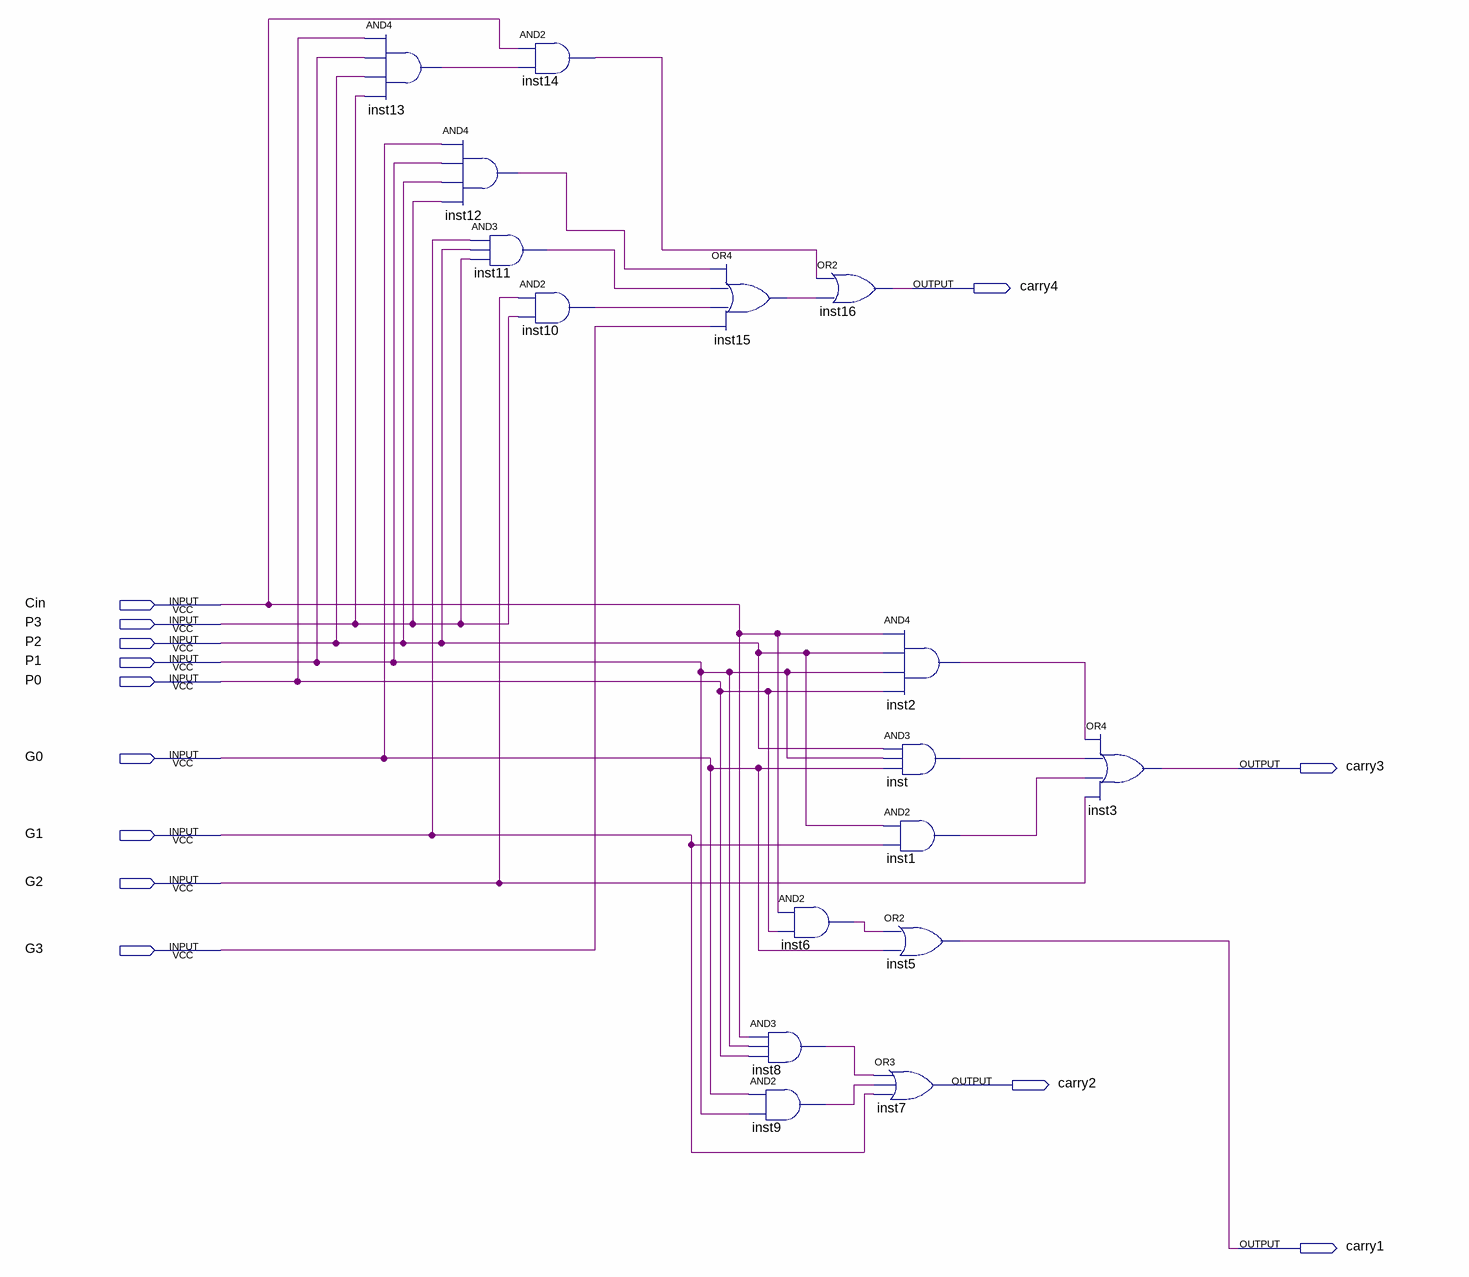
[diagram p0: schematic sheet]
// Quartus schematic clu4.bdf as structural Verilog: 16 symbols, 13 pins
module clu4 (
  input  Cin,
  input  P3,
  input  P2,
  input  P1,
  input  P0,
  input  G0,
  input  G1,
  input  G2,
  input  G3,
  output carry4,
  output carry3,
  output carry2,
  output carry1
);

  wire inst1_out, inst2_out, inst6_out, inst8_out, inst9_out, inst10_out, inst11_out, inst12_out, inst13_out,
       inst14_out, inst15_out, inst_out;

  and inst13 (inst13_out, P0, P1, P2, P3);
  and inst12 (inst12_out, G0, P1, P2, P3);
  and inst11 (inst11_out, G1, P2, P3);
  and inst14 (inst14_out, Cin, inst13_out);
  and inst10 (inst10_out, G2, P3);
  or inst15 (inst15_out, inst12_out, inst11_out, inst10_out, G3);
  and inst6 (inst6_out, Cin, P0);
  and inst8 (inst8_out, Cin, P1, P0);
  and inst9 (inst9_out, G0, P1);
  or inst16 (carry4, inst14_out, inst15_out);
  and inst2 (inst2_out, Cin, P2, P1, P0);
  and inst (inst_out, P2, P1, G0);
  and inst1 (inst1_out, P2, G1);
  or inst5 (carry1, inst6_out, G0);
  or inst7 (carry2, inst8_out, inst9_out, G1);
  or inst3 (carry3, inst2_out, inst_out, inst1_out, G2);
endmodule
